# EasyEDA Pro project Databoard.epro

# Schematic Schematic1
Board Name: Board1; Create Date: 2025-08-02; Page Name: P1; Project Name: Databoard; Schematic Name: Schematic1; Update Date: 2025-08-05; Company: EasyEDA.com; Page Size: A4; Version: V1.0
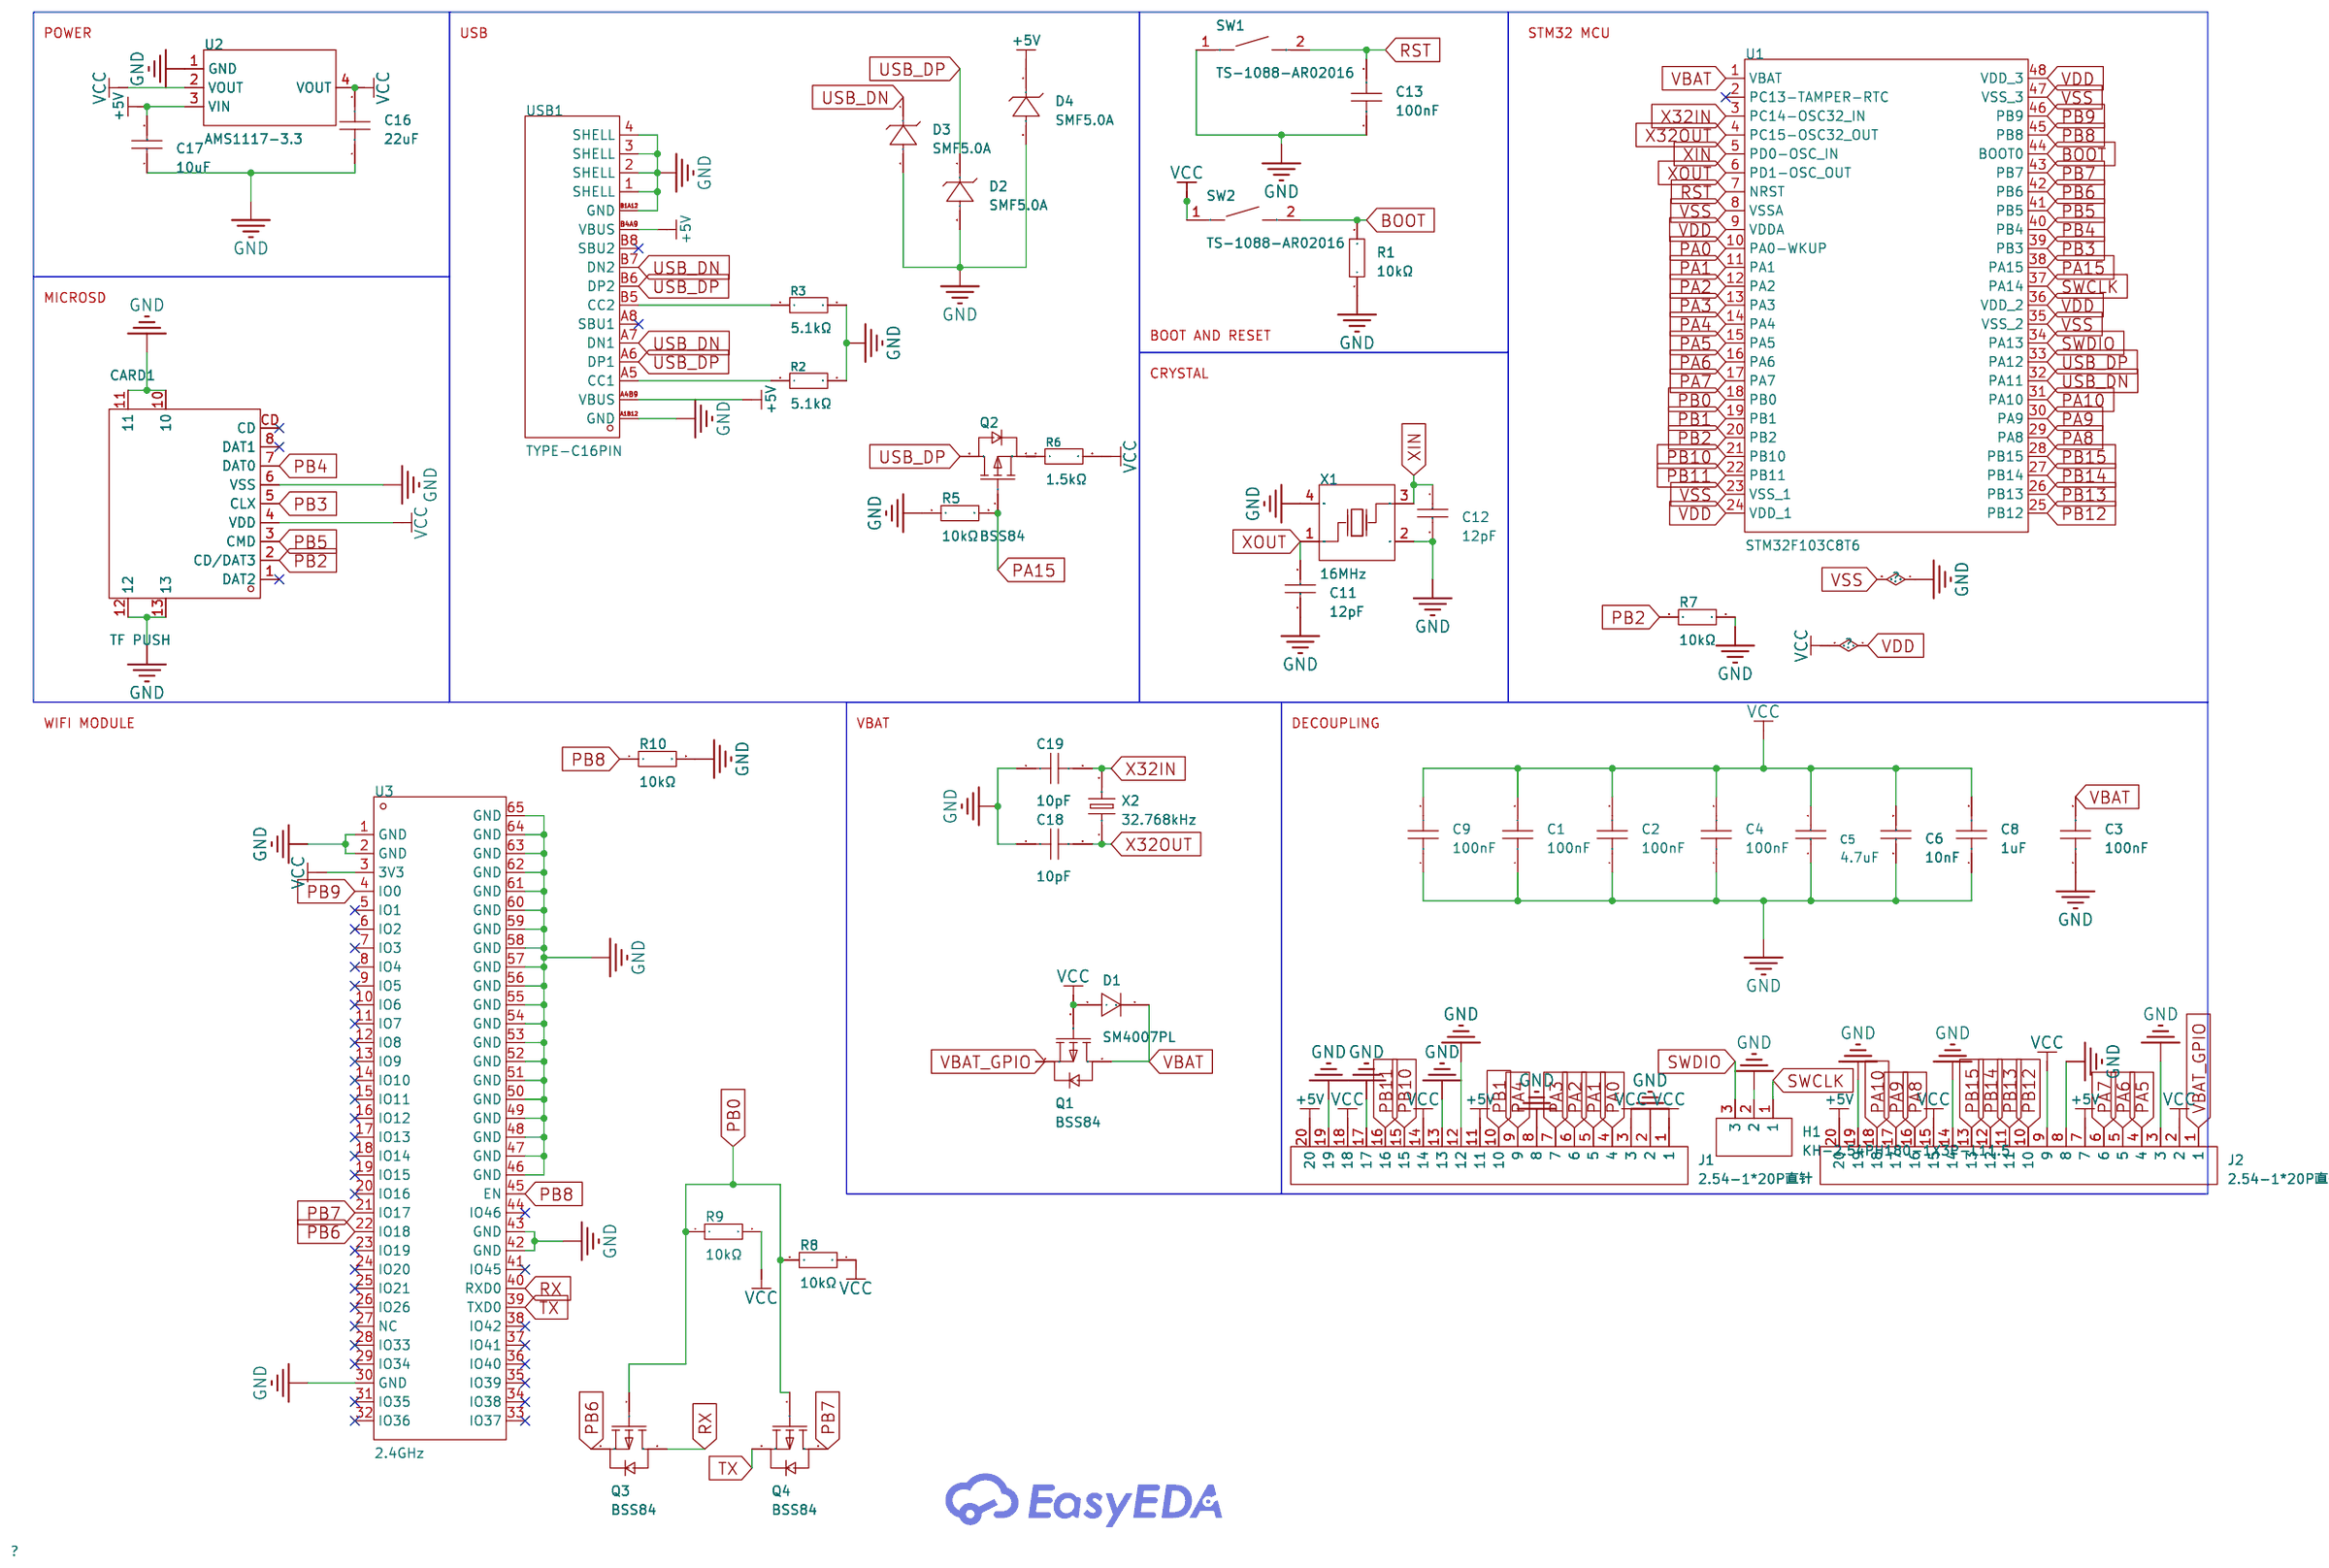
[diagram p0: schematic sheet]

## Parts
C1  100nF  [C0402]
C2  100nF  [C0402]
C3  100nF  [C0402]
C4  100nF  [C0402]
C5  4.7uF  [C0402]
C6  10nF  [C0402]
C8  1uF  [C0402]
C9  100nF  [C0402]
C11  12pF  [C0402]
C12  12pF  [C0402]
C13  100nF  [C0402]
C16  22uF  [C0603]
C17  10uF  [C0402]
C18  10pF  [C0402]
C19  10pF  [C0402]
CARD1  TF PUSH  [TF-SMD_TF-PUSH]
D1  SM4007PL  [SOD-123F_L2.8-W1.8-LS3.7-RD]
D2  SMF5.0A  [SOD-123FL_L2.7-W1.8-LS3.8-RD]
D3  SMF5.0A  [SOD-123FL_L2.7-W1.8-LS3.8-RD]
D4  SMF5.0A  [SOD-123FL_L2.7-W1.8-LS3.8-RD]
H1  KH-2.54PH180-1X3P-L11.5  [HDR-TH_3P-P2.54-V-M]
J1  2.54-1*20P直针  [HDR-TH_20P-P2.54-V-M-1]
J2  2.54-1*20P直针  [HDR-TH_20P-P2.54-V-M-1]
Q1  BSS84  [SOT-23-3_L2.9-W1.3-P1.90-LS2.4-BR-1]
Q2  BSS84  [SOT-23-3_L2.9-W1.3-P1.90-LS2.4-BR-1]
Q3  BSS84  [SOT-23-3_L2.9-W1.3-P1.90-LS2.4-BR-1]
Q4  BSS84  [SOT-23-3_L2.9-W1.3-P1.90-LS2.4-BR-1]
R1  10kΩ  [R0402]
R2  5.1kΩ  [R0402]
R3  5.1kΩ  [R0402]
R5  10kΩ  [R0402]
R6  1.5kΩ  [R0402]
R7  10kΩ  [R0402]
R8  10kΩ  [R0402]
R9  10kΩ  [R0402]
R10  10kΩ  [R0402]
SW1  TS-1088-AR02016  [SW-SMD_L3.9-W3.0-P4.45]
SW2  TS-1088-AR02016  [SW-SMD_L3.9-W3.0-P4.45]
U1  STM32F103C8T6  [LQFP-48_L7.0-W7.0-P0.50-LS9.0-BL]
U2  AMS1117-3.3  [SOT-223-3_L6.5-W3.4-P2.30-LS7.0-BR]
U3  2.4GHz  [WIFI-SMD_ESP32-MINI-1-N4]
USB1  TYPE-C16PIN  [USB-C-SMD_TYPE-C16PIN]
X1  16MHz  [OSC-SMD_4P-L3.2-W2.5-BL]
X2  32.768kHz  [OSC-SMD_L3.2-W1.5]

## Library data of the parts
C1-C4 C9 C13 = CL05B104KB54PNC: Capacitance: Tolerance:±10% Tolerance:±10% Voltage Rated: Temperature Coefficient:; LCSC Part Name: 100nF ±10% 50V; Supplier Part: C307331; Manufacturer: SAMSUNG(三星); Supplier Footprint: 0402; JLCPCB Part Class: Basic Part; Datasheet: https://atta.szlcsc.com/upload/public/pdf/source/20160218/1457707763339.pdf; Supplier: LCSC; Tolerance: ±10%
C5 = CL05A475MP5NRNC: Capacitance: Tolerance:±20% Tolerance:±20% Voltage Rated: Temperature Coefficient:; LCSC Part Name: 4.7uF ±20% 10V; Supplier Part: C23733; Manufacturer: SAMSUNG(三星); Supplier Footprint: 0402; JLCPCB Part Class: Basic Part; Datasheet: https://atta.szlcsc.com/upload/public/pdf/source/20160218/1457707763339.pdf; Supplier: LCSC; Tolerance: ±20%
C6 = CL05B103KB5NNNC: Capacitance: Tolerance:±10% Tolerance:±10% Voltage Rated: Temperature Coefficient:; LCSC Part Name: 10nF ±10% 50V; Supplier Part: C15195; Manufacturer: SAMSUNG(三星); Supplier Footprint: 0402; JLCPCB Part Class: Basic Part; Datasheet: https://atta.szlcsc.com/upload/public/pdf/source/20160218/1457707763339.pdf; Supplier: LCSC; Tolerance: ±10%
C8 = CL05A105KA5NQNC: Capacitance: Tolerance:±10% Tolerance:±10% Voltage Rated: Temperature Coefficient:; LCSC Part Name: 1uF ±10% 25V; Supplier Part: C52923; Manufacturer: SAMSUNG(三星); Supplier Footprint: 0402; JLCPCB Part Class: Basic Part; Datasheet: https://atta.szlcsc.com/upload/public/pdf/source/20160218/1457707763339.pdf; Supplier: LCSC; Tolerance: ±10%
C11 C12 = 0402CG120J500NT: Capacitance: Tolerance:±5% Tolerance:±5% Voltage Rated: Temperature Coefficient:; LCSC Part Name: 12pF ±5% 50V; Supplier Part: C1547; Manufacturer: FH(风华); Supplier Footprint: 0402; JLCPCB Part Class: Basic Part; Datasheet: https://atta.szlcsc.com/upload/public/pdf/source/20200305/C486355_26A10D38EF8C2A5C37091D0039909270.pdf; Supplier: LCSC; Tolerance: ±5%
C16 = CL10A226MQ8NRNC: Capacitance: Tolerance:±20% Tolerance:±20% Voltage Rated: Temperature Coefficient:; LCSC Part Name: 22uF ±20% 6.3V; Supplier Part: C59461; Manufacturer: SAMSUNG(三星); Supplier Footprint: 0603; JLCPCB Part Class: Basic Part; Datasheet: https://atta.szlcsc.com/upload/public/pdf/source/20160218/1457707763339.pdf; Supplier: LCSC; Tolerance: ±20%
C17 = CL05A106MQ5NUNC: Capacitance: Tolerance:±20% Tolerance:±20% Voltage Rated: Temperature Coefficient:; LCSC Part Name: 10uF ±20% 6.3V; Supplier Part: C15525; Manufacturer: SAMSUNG(三星); Supplier Footprint: 0402; JLCPCB Part Class: Basic Part; Datasheet: https://atta.szlcsc.com/upload/public/pdf/source/20220823/2B02EE04F8F211D38A52DCB16EB6BEBA.pdf; Supplier: LCSC; Tolerance: ±20%
C18 C19 = CL05C100JB5NNNC: Capacitance: Tolerance:±5% Tolerance:±5% Voltage Rated: Temperature Coefficient:; LCSC Part Name: 10pF ±5% 50V; Supplier Part: C32949; Manufacturer: SAMSUNG(三星); Supplier Footprint: 0402; JLCPCB Part Class: Basic Part; Datasheet: https://atta.szlcsc.com/upload/public/pdf/source/20160218/1457707763339.pdf; Supplier: LCSC; Tolerance: ±5%
CARD1 = TF PUSH: Card Connection Mode:Self-bouncing Card Type:MicroSD card (TF card) Connector Type:Card Slot Additional Card Detection Pins:None Supplementary Features:- Maximum Body Height:2mm Operating Temperature Range:-20℃~+90℃ Operating Temperature Range:-20℃~+90℃; LCSC Part Name: 自弹式 MicroSD卡(TF卡) 卡座; Supplier Part: C393941; Manufacturer: SHOU HAN(首韩); Supplier Footprint: SMD; JLCPCB Part Class: Extended Part; Datasheet: https://atta.szlcsc.com/upload/public/pdf/source/20191011/C393941_0DDD896EE907FEB750D8B7B8982E2A67.pdf; Supplier: LCSC; Card Connection Mode: Self-bouncing; Card Type: MicroSD card (TF card); Connector Type: Card Slot; Additional Card Detection Pins: None; Maximum Body Height: 2mm; Operating Temperature Range: -20℃~+90℃
D1 = SM4007PL_C64898: Diode Configuration:Independent Type Voltage - Forward(Vf@If):1.1V@1A Voltage - DC Reverse(Vr):1kV Current - Rectified:1A Reverse Leakage Current (Ir):10uA@1kV; Supplier Part: C64898; Manufacturer: MDD(辰达半导体); Supplier Footprint: SOD-123FL; JLCPCB Part Class: Basic Part; Datasheet: https://atta.szlcsc.com/upload/public/pdf/source/20241121/400BA5297D1B92A42708AD93AB64CE21.pdf; Supplier: LCSC; Diode Configuration: Independent Type; Voltage - Forward(Vf@If): 1.1V@1A; Voltage - DC Reverse(Vr): 1kV; Current - Rectified: 1A; Reverse Leakage Current (Ir): 10uA@1kV
D2-D4 = SMF5.0A_C19077497: polarity:Unidirectional Reverse Stand-Off Voltage (Vrwm):5V Maximum Clamping Voltage:7.3V Peak Pulse Current (Ipp):27.4A Peak Pulse Power Dissipation (Ppp):200W Breakdown Voltage:6.4V Reverse Leakage Current (Ir):400uA Number of Lines:Single Channel Opera; Supplier Part: C19077497; Manufacturer: 宏迦橙; Supplier Footprint: SOD-123FL; JLCPCB Part Class: Extended Part; Datasheet: https://atta.szlcsc.com/upload/public/pdf/source/20231129/4813F17DC56F8B344A8D004597B3633C.pdf; Supplier: LCSC; polarity: Unidirectional; Reverse Stand-Off Voltage (Vrwm): 5V; Maximum Clamping Voltage: 7.3V; Peak Pulse Current (Ipp): 27.4A; Peak Pulse Power Dissipation (Ppp): 200W; Breakdown Voltage: 6.4V; Reverse Leakage Current (Ir): 400uA; Number of Lines: Single Channel; Operating Temperature: -55℃~+155℃; Type: TVS
H1 = KH-2.54PH180-1X3P-L11.5: Pin Structure:1x3P Pitch:2.54mm Row Spacing:- Circluar Pins/Square Pins:Policy Mounting Type:Straight Number of Rows:Single Row Number of Pins:3P Current Rating:3A Voltage Rating (Max):- Length of Mating Pin:6mm Insulation Height:2.5mm Length of End Conne; LCSC Part Name: 1x3P 间距:2.54mm 方针 直插; Supplier Part: C2932698; Manufacturer: kinghelm(金航标); Supplier Footprint: 插件,P=2.54mm; JLCPCB Part Class: Extended Part; Datasheet: https://atta.szlcsc.com/upload/public/pdf/source/20211220/D2AB060C07EA7DD91A5B4AA994AB98CA.pdf; Supplier: LCSC; Pin Structure: 1x3P; Pitch: 2.54mm; Circluar Pins/Square Pins: Policy; Mounting Type: Straight; Number of Rows: Single Row; Number of Pins: 3P; Current Rating: 3A; Length of Mating Pin: 6mm; Insulation Height: 2.5mm; Length of End Connection Pin: 3mm; Operating Temperature: -40℃~+105℃; Color: Black
J1 J2 = 2.54-1*20P直针: Pin Structure:1x20P Pitch:2.54mm Row Spacing:- Circluar Pins/Square Pins:Policy Mounting Type:Straight Number of Rows:Single Row Number of Pins:20P Current Rating:3A Voltage Rating (Max):- Length of Mating Pin:- Insulation Height:- Length of End Connectio; LCSC Part Name: 1x20P 间距:2.54mm 方针 直插; Supplier Part: C50981; Manufacturer: BOOMELE(博穆精密); Supplier Footprint: 插件,P=2.54mm; JLCPCB Part Class: Extended Part; Datasheet: https://atta.szlcsc.com/upload/public/pdf/source/20151109/1457707572883.pdf; Supplier: LCSC; Pin Structure: 1x20P; Pitch: 2.54mm; Circluar Pins/Square Pins: Policy; Mounting Type: Straight; Number of Rows: Single Row; Number of Pins: 20P; Current Rating: 3A; Contact Material: Brass; Operating Temperature: -40℃~+105℃; Color: Black
Q1-Q4 = BSS84_C7420340: Type:1 piece P-channel Drain to Source Voltage:60V Current - Continuous Drain(Id):170mA RDS(on):8Ω@10V,0.17A Pd - Power Dissipation:225mW Gate Threshold Voltage (Vgs(th)@Id):900mV Gate Charge(Qg):1.77nC@10V Input Capacitance(Ciss@Vds):43pF Reverse Transfe; LCSC Part Name: P沟道,电流:-0.17A,耐压:-60V; Supplier Part: C7420340; Manufacturer: 宏嘉诚; Supplier Footprint: SOT-23; JLCPCB Part Class: Extended Part; Datasheet: https://atta.szlcsc.com/upload/public/pdf/source/20250106/7DBB75318F8E5F43EACD3BE75B7C3ED0.pdf; Supplier: LCSC; Type: 1 piece P-channel; Drain to Source Voltage: 60V; Current - Continuous Drain(Id): 170mA; RDS(on): 8Ω@10V,0.17A; Pd - Power Dissipation: 225mW; Gate Threshold Voltage (Vgs(th)@Id): 900mV; Gate Charge(Qg): 1.77nC@10V; Input Capacitance(Ciss@Vds): 43pF; Reverse Transfer Capacitance (Crss@Vds): 2.8pF; Operating Temperature: -55℃~+150℃
R1 R5 R7-R10 = 0402WGF1002TCE: Type:Thick Film Resistors Resistance:10kΩ Tolerance:±1% Tolerance:±1% Power(Watts): Overload Voltage (Max): Temperature Coefficient:±100ppm/℃ Temperature Coefficient:±100ppm/℃ Operating Temperature Range:-55℃~+155℃ Operating Temperature Range:-55℃~+155℃; LCSC Part Name: 10kΩ ±1% 62.5mW 厚膜电阻; Supplier Part: C25744; Manufacturer: UNI-ROYAL(厚声); Supplier Footprint: 0402; JLCPCB Part Class: Basic Part; Datasheet: https://atta.szlcsc.com/upload/public/pdf/source/20200306/C422600_1E6D84923E4A46A82E41ADD87F860B5C.pdf; Supplier: LCSC; Type: Thick Film Resistors; Tolerance: ±1%; Temperature Coefficient: ±100ppm/℃; Operating Temperature Range: -55℃~+155℃
R2 R3 = 0402WGF5101TCE: Type:Thick Film Resistor Resistance:5.1kΩ Tolerance:±1% Tolerance:±1% Power(Watts):62.5mW Voltage-Supply(Max):50V Temperature Coefficient:±100ppm/℃ Temperature Coefficient:±100ppm/℃ Operating Temperature:-55℃~+155℃ Operating Temperature:-55℃~+155℃; LCSC Part Name: 5.1kΩ ±1% 62.5mW 厚膜电阻; Supplier Part: C25905; Manufacturer: UNI-ROYAL(厚声); Supplier Footprint: 0402; JLCPCB Part Class: Basic Part; Datasheet: https://atta.szlcsc.com/upload/public/pdf/source/20200306/C422600_1E6D84923E4A46A82E41ADD87F860B5C.pdf; Supplier: LCSC; Type: Thick Film Resistor; Tolerance: ±1%; Power(Watts): 62.5mW; Voltage-Supply(Max): 50V; Temperature Coefficient: ±100ppm/℃; Operating Temperature: -55℃~+155℃
R6 = 0402WGF1501TCE: Type:Thick Film Resistors Resistance:1.5kΩ Tolerance:±1% Tolerance:±1% Power(Watts): Overload Voltage (Max): Temperature Coefficient:±100ppm/℃ Temperature Coefficient:±100ppm/℃ Operating Temperature Range:-55℃~+155℃ Operating Temperature Range:-55℃~+155℃; LCSC Part Name: 1.5kΩ ±1% 62.5mW 厚膜电阻; Supplier Part: C25867; Manufacturer: UNI-ROYAL(厚声); Supplier Footprint: 0402; JLCPCB Part Class: Basic Part; Datasheet: https://atta.szlcsc.com/upload/public/pdf/source/20200306/C422600_1E6D84923E4A46A82E41ADD87F860B5C.pdf; Supplier: LCSC; Type: Thick Film Resistors; Tolerance: ±1%; Temperature Coefficient: ±100ppm/℃; Operating Temperature Range: -55℃~+155℃
SW1 SW2 = TS-1088-AR02016: Circuit:SPST Actuator Style:Round Button Operating Force:160gf Mounting Style:Brick nogging Switch Length:4mm Switch Width:3mm Switch Height:2mm Strike Gundam:不带 Contact Current:50mA Voltage Rating (DC):12V Insulation Resistance:100MΩ Actuator/Cap Color:B; LCSC Part Name: 4*3*2mm 立贴 轻触开关; Supplier Part: C720477; Manufacturer: XUNPU(讯普); Supplier Footprint: SMD; JLCPCB Part Class: Basic Part; Datasheet: https://atta.szlcsc.com/upload/public/pdf/source/20200810/C720475_60D09DD6C54279ADDB2DC25100F1CC11.pdf; Supplier: LCSC; Circuit: SPST; Actuator Style: Round Button; Operating Force: 160gf; Mounting Style: Brick nogging; Switch Length: 4mm; Switch Width: 3mm; Switch Height: 2mm; Strike Gundam: 不带; Contact Current: 50mA; Voltage Rating (DC): 12V; Insulation Resistance: 100MΩ; Actuator/Cap Color: Black; Pin Style: SMDSplicing; Mechanical Life: 10万次; Operating Temperature: -30℃~+80℃
U1 = STM32F103C8T6: CPU Core:ARM-M3 CPU Maximum Speed:72MHz Program Storage Size:64KB Program Memory Type:FLASH Number of I/O:37 ADC (Bit):12bit Voltage - Supply:2V~3.6V Voltage - Supply:2V~3.6V Applications:-; LCSC Part Name: 主流增强型ARM Cortex-M3 MCU，具有64 KB Flash、72 MHz CPU、电机控制、USB和CAN; Supplier Part: C8734; Manufacturer: ST(意法半导体); Supplier Footprint: LQFP-48(7x7); JLCPCB Part Class: Extended Part; Datasheet: https://atta.szlcsc.com/upload/public/pdf/source/20220812/8363ACEC51AD55ECEB84799464F7CB85.pdf; Supplier: LCSC; CPU Core: ARM-M3; CPU Maximum Speed: 72MHz; Program Storage Size: 64KB; Program Memory Type: FLASH; Number of I/O: 37; ADC (Bit): 12bit; Voltage - Supply: 2V~3.6V
U2 = AMS1117-3.3_C6186: Output Type:Fixed Voltage - Supply:16V Output Voltage:3.3V Output Voltage:3.3V Output Current:1A Power Supply Rejection Ratio (PSRR):72dB@(120Hz) Voltage Dropout:1.1V@(800mA) standby current:5mA Noise:- Features:Over Current Protection；Over Temperature Pr; LCSC Part Name: 输出3.3V 1A; Supplier Part: C6186; Manufacturer: AMS; Supplier Footprint: SOT-223; JLCPCB Part Class: Basic Part; Datasheet: https://atta.szlcsc.com/upload/public/pdf/source/20180727/C6186_7A095716F0823C02F1997A905E26C086.pdf; Supplier: LCSC; Output Type: Fixed; Voltage - Supply: 16V; Output Voltage: 3.3V; Output Current: 1A; Power Supply Rejection Ratio (PSRR): 72dB@(120Hz); Voltage Dropout: 1.1V@(800mA); standby current: 5mA; Features: Over Current Protection；Over Temperature Protection; Operating Temperature: -40℃~+125℃; Output Configuration: Positive; Number of Outputs: 1
U3 = ESP32-S2-MINI-2-N4: Core Processor:ESP32-S2FH4 chip Support Interface:I2C；GPIO；SPI；PWM；ADC；UART；USB；I2S Frequency:2.4GHz Output Power:19.5dBm Output Power:19.5dBm; Supplier Part: C3013906; Manufacturer: ESPRESSIF(乐鑫); Supplier Footprint: SMD; JLCPCB Part Class: Extended Part; Datasheet: https://atta.szlcsc.com/upload/public/pdf/source/20220815/99ECD7479F9259A66C7C6E1140388E9F.pdf; Supplier: LCSC; Core Processor: ESP32-S2FH4 chip; Support Interface: I2C；GPIO；SPI；PWM；ADC；UART；USB；I2S; Output Power: 19.5dBm
USB1 = TYPE-C16PIN: Connector Type:Type-C Protocol Standard:USB 3.1 Gender:Female Mounting Type:Surface Mount, Right Angle Number of Contacts:16P Number of Ports:1 Current Rating-Power:3A Voltage Rating:30V Connect-Disconnect Life:10,000 Cycles Detection color:Black Operatin; LCSC Part Name: Type-C 母 卧贴; Supplier Part: C393939; Manufacturer: SHOU HAN(首韩); Supplier Footprint: SMD; JLCPCB Part Class: Extended Part; Datasheet: https://atta.szlcsc.com/upload/public/pdf/source/20250618/9FBF2A26CFCE0E69298FA0B726710E9E.pdf; Supplier: LCSC; Connector Type: Type-C; Protocol Standard: USB 3.1; Gender: Female; Mounting Type: Surface Mount, Right Angle; Number of Contacts: 16P; Number of Ports: 1; Current Rating-Power: 3A; Voltage Rating: 30V; Connect-Disconnect Life: 10,000 Cycles; Detection color: Black; Operating Temperature: -40℃~+85℃
X1 = X322516MLB4SI: Type:Surface Mount Crystal Frequency:16MHz Normal temperature Frequency Tolerance:±10ppm Normal temperature Frequency Tolerance:±10ppm Load Capacitance:9pF Frequency Stability:±20ppm Frequency Stability:±20ppm Operating Temperature:-40℃~+85℃ Operating Tem; LCSC Part Name: YSX321SL 16MHZ 4P 3225 9PF ±10PPM -40~85℃ (±20PPM); Supplier Part: C13738; Manufacturer: YXC(扬兴晶振); Supplier Footprint: SMD3225-4P; JLCPCB Part Class: Basic Part; Datasheet: https://atta.szlcsc.com/upload/public/pdf/source/20240329/19D5F850207469550BEB00D7DFEDBC7A.pdf; Supplier: LCSC; Type: Surface Mount Crystal; Normal temperature Frequency Tolerance: ±10ppm; Load Capacitance: 9pF; Frequency Stability: ±20ppm; Operating Temperature: -40℃~+85℃
X2 = SC-32S32.768kHz20PPM7pF: Type:- Frequency:32.768kHz Normal temperature Frequency Tolerance:±20ppm Normal temperature Frequency Tolerance:±20ppm Load Capacitance: Operating Temperature:- Operating Temperature:-; LCSC Part Name: 32.768kHz ±20ppm 7pF; Supplier Part: C97604; Manufacturer: Seiko(精工); Supplier Footprint: SMD3215-2P; JLCPCB Part Class: Extended Part; Datasheet: https://atta.szlcsc.com/upload/public/pdf/source/20170329/1490752773868.pdf; Supplier: LCSC; Normal temperature Frequency Tolerance: ±20ppm

## Nets
+5V: C17.2 D4.1(K) J1.11 J1.20 J2.7 J2.20 U2.3(VIN) USB1.A4B9(VBUS) USB1.B4A9(VBUS)
GND: C1.1 C2.1 C3.1 C4.1 C5.1 C6.1 C8.1 C9.1 C11.1 C12.2 C13.1 C16.1 C17.1 C18.1 C19.1 CARD1.6(VSS) CARD1.10 CARD1.11 CARD1.12 CARD1.13 D2.2(A) D3.2(A) D4.2(A) H1.2 J1.2 J1.8 J1.12 J1.13 J1.17 J1.19 J2.3 J2.8 J2.14 J2.19 R1.1 R2.2 R3.2 R5.1 R7.1 R10.2 SW1.1 U1.8(VSSA) U1.23(VSS_1) U1.35(VSS_2) U1.47(VSS_3) U2.1(GND) U3.1(GND) U3.2(GND) U3.30(GND) U3.42(GND) U3.43(GND) U3.46(GND) U3.47(GND) U3.48(GND) U3.49(GND) U3.50(GND) U3.51(GND) U3.52(GND) U3.53(GND) U3.54(GND) U3.55(GND) U3.56(GND) U3.57(GND) U3.58(GND) U3.59(GND) U3.60(GND) U3.61(GND) U3.62(GND) U3.63(GND) U3.64(GND) U3.65(GND) USB1.1(SHELL) USB1.2(SHELL) USB1.3(SHELL) USB1.4(SHELL) USB1.A1B12(GND) USB1.B1A12(GND) X1.2(GND) X1.4(GND)
VBAT: C3.2 D1.1(C) Q1.3(D) U1.1(VBAT)
VBAT_GPIO: J2.1 Q1.2(S)
VCC: C1.2 C2.2 C4.2 C5.2 C6.2 C8.2 C9.2 C16.2 CARD1.4(VDD) D1.2(A) J1.1 J1.3 J1.14 J1.18 J2.2 J2.9 J2.15 Q1.1(G) R6.2 R8.1 R9.2 SW2.1 U1.9(VDDA) U1.24(VDD_1) U1.36(VDD_2) U1.48(VDD_3) U2.2(VOUT) U2.4(VOUT) U3.3(3V3)
BOOT: R1.2 SW2.2 U1.44(BOOT0)
PA0: J1.4 U1.10(PA0-WKUP)
PA1: J1.5 U1.11(PA1)
PA2: J1.6 U1.12(PA2)
PA3: J1.7 U1.13(PA3)
PA4: J1.9 U1.14(PA4)
PA5: J2.4 U1.15(PA5)
PA6: J2.5 U1.16(PA6)
PA7: J2.6 U1.17(PA7)
PA8: J2.16 U1.29(PA8)
PA9: J2.17 U1.30(PA9)
PA10: J2.18 U1.31(PA10)
PA15: Q2.1(G) R5.2 U1.38(PA15)
PB0: Q3.1(G) Q4.1(G) R8.2 R9.1 U1.18(PB0)
PB1: J1.10 U1.19(PB1)
PB2: CARD1.2(CD/DAT3) R7.2 U1.20(PB2)
PB3: CARD1.5(CLX) U1.39(PB3)
PB4: CARD1.7(DAT0) U1.40(PB4)
PB5: CARD1.3(CMD) U1.41(PB5)
PB6: Q3.2(S) U1.42(PB6) U3.22(IO18)
PB7: Q4.3(D) U1.43(PB7) U3.21(IO17)
PB8: R10.1 U1.45(PB8) U3.45(EN)
PB9: U1.46(PB9) U3.4(IO0)
PB10: J1.15 U1.21(PB10)
PB11: J1.16 U1.22(PB11)
PB12: J2.10 U1.25(PB12)
PB13: J2.11 U1.26(PB13)
PB14: J2.12 U1.27(PB14)
PB15: J2.13 U1.28(PB15)
RST: C13.2 SW1.2 U1.7(NRST)
RX: Q3.3(D) U3.40(RXD0)
SWCLK: H1.1 U1.37(PA14)
SWDIO: H1.3 U1.34(PA13)
TX: Q4.2(S) U3.39(TXD0)
USB_DN: D3.1(K) U1.32(PA11) USB1.A7(DN1) USB1.B7(DN2)
USB_DP: D2.1(K) Q2.3(D) U1.33(PA12) USB1.A6(DP1) USB1.B6(DP2)
X32IN: C19.2 U1.3(PC14-OSC32_IN) X2.2
X32OUT: C18.2 U1.4(PC15-OSC32_OUT) X2.1
XIN: C12.1 U1.5(PD0-OSC_IN) X1.3(OSC2)
XOUT: C11.2 U1.6(PD1-OSC_OUT) X1.1(OSC1)
$1N4270: R3.1 USB1.B5(CC2)
$1N4274: R2.1 USB1.A5(CC1)
$1N5199: Q2.2(S) R6.1

Not connected (* = marked no-connect by the designer): CARD1 1(DAT2)* 8(DAT1)* CD*; U1 2(PC13-TAMPER-RTC)*; U3 5(IO1)* 6(IO2)* 7(IO3)* 8(IO4)* 9(IO5)* 10(IO6)* 11(IO7)* 12(IO8)* 13(IO9)* 14(IO10)* 15(IO11)* 16(IO12)* 17(IO13)* 18(IO14)* 19(IO15)* 20(IO16)* 23(IO19)* 24(IO20)* 25(IO21)* 26(IO26)* 27(NC)* 28(IO33)* 29(IO34)* 31(IO35)* 32(IO36)* 33(IO37)* 34(IO38)* 35(IO39)* 36(IO40)* 37(IO41)* 38(IO42)* 41(IO45)* 44(IO46)*; USB1 A8(SBU1)* B8(SBU2)*

## Notes on the sheet
- POWER
- USB
- STM32 MCU
- MICROSD
- BOOT AND RESET
- CRYSTAL
- WIFI MODULE
- VBAT
- DECOUPLING

# Board PCB1
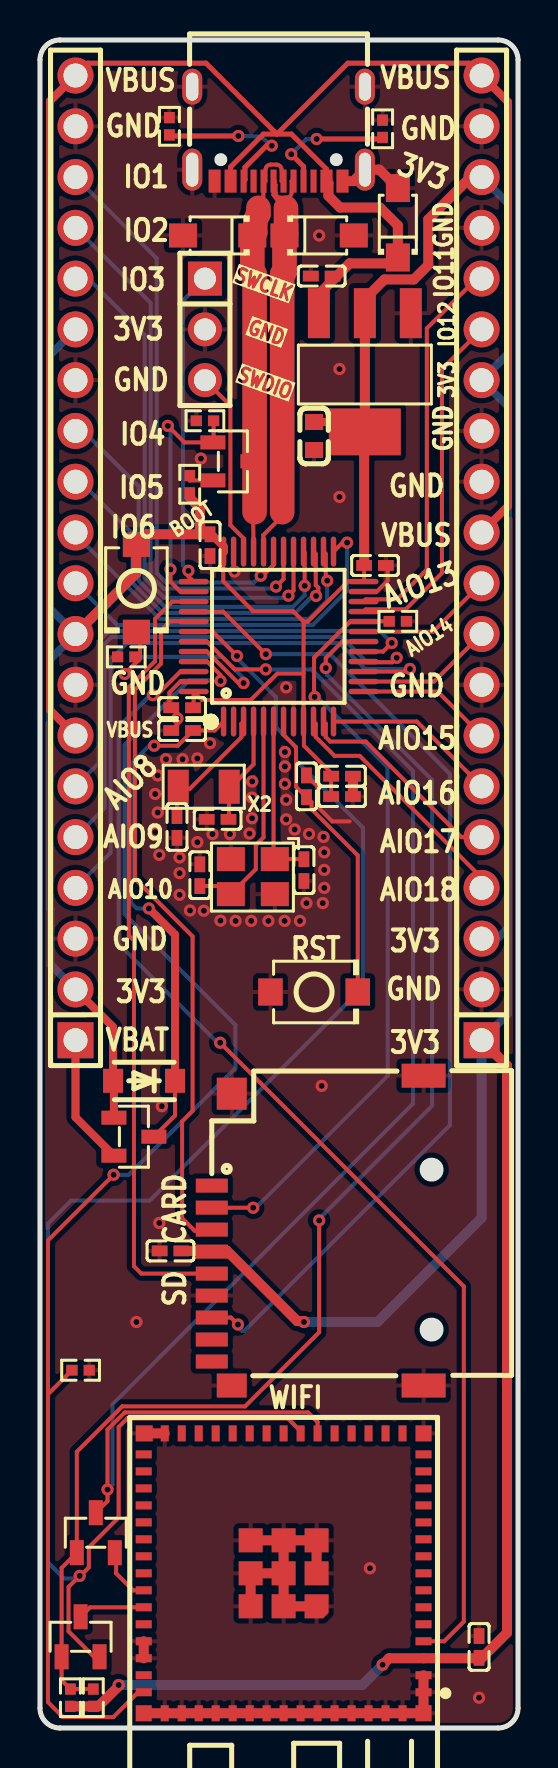
[diagram p1: board, top side]
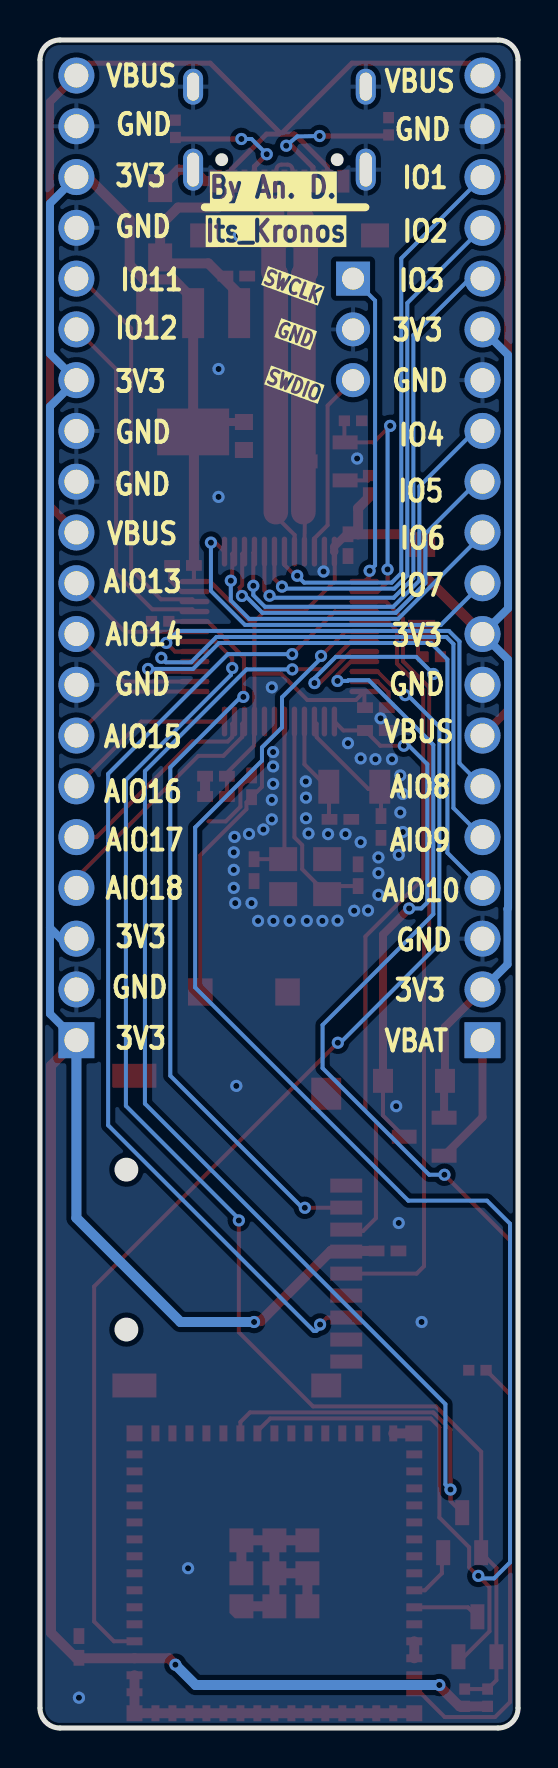
[diagram p2: board, bottom side, seen from below]

Outline 23.92 x 84.45 mm; copper layers: Top Layer, Bottom Layer. Coordinates in mm from the lower left corner of the outline.
Outline path: 0,83.45 0,1 arc(0.29,0.29) 1,0 22.92,0 arc(23.63,0.29) 23.92,1 23.92,83.45 arc(23.63,84.15) 22.92,84.45 1,84.45 arc(0.29,84.15) 0,83.45
Stack: Top Layer 0.035mm / Dielectric1 1.51mm FR4 er 4.5 / Bottom Layer 0.035mm

## Design rules (mm)
net USB_DP: DP1
net USB_DN: DP1
template: Custom Config
spacing copperThickness1oz (default): track to track 0.102, other pairs 0.152 to 0.3
spacing copperThickness2oz: track to track 0.203, other pairs 0.152 to 0.3
track width copperThickness1oz (default): min 0.127, default 0.254, max 2.54
track width copperThickness2oz: min 0.203, default 0.254, max 2.54
differential pair differentialPair (default): width min 0.127, default 0.254, max 2.54; gap min 0.15, default 0.15
via viaSize (default): diameter min 0.5, default 0.61, max 10; hole min 0.3, default 0.305, max 6.3

## Placement (name value [footprint] x y rotation side)
C1  100nF  [C0402]  8.51 59.17 90 top
C2  100nF  [C0402]  16.76 58.16 180 top
C3  100nF  [C0402]  7.11 49.9 0 top
C4  100nF  [C0402]  21.97 4.06 270 top
C5  4.7uF  [C0402]  7.11 51.05 0 top
C6  10nF  [C0402]  15.11 46.6 180 top
C8  1uF  [C0402]  15.11 47.62 180 top
C9  100nF  [C0402]  6.53 23.87 0 top
C11  12pF  [C0402]  13.21 42.92 90 top
C12  12pF  [C0402]  8 42.66 90 top
C13  100nF  [C0402]  13.34 47.11 270 top
C16  22uF  [C0603]  13.72 64.64 90 top
C17  10uF  [C0402]  14.1 72.64 0 top
C18  10pF  [C0402]  8.89 45.46 0 top
C19  10pF  [C0402]  6.86 45.08 90 top
CARD1  TF PUSH  [TF-SMD_TF-PUSH]  13.9 24.88 90 top
D1  SM4007PL  [SOD-123F_L2.8-W1.8-LS3.7-RD]  5.21 32.38 180 top
D2  SMF5.0A  [SOD-123FL_L2.7-W1.8-LS3.8-RD]  8.89 74.67 180 top
D3  SMF5.0A  [SOD-123FL_L2.7-W1.8-LS3.8-RD]  13.97 74.67 0 top
D4  SMF5.0A  [SOD-123FL_L2.7-W1.8-LS3.8-RD]  17.91 75.3 90 top
H1  KH-2.54PH180-1X3P-L11.5  [HDR-TH_3P-P2.54-V-M]  8.25 69.97 270 top
J1  2.54-1*20P直针  [HDR-TH_20P-P2.54-V-M-1]  22.1 58.54 90 top
J2  2.54-1*20P直针  [HDR-TH_20P-P2.54-V-M-1]  1.78 58.54 90 top
Q1  BSS84  [SOT-23-3_L2.9-W1.3-P1.90-LS2.4-BR-1]  4.7 29.58 180 top
Q2  BSS84  [SOT-23-3_L2.9-W1.3-P1.90-LS2.4-BR-1]  9.65 63.37 180 top
Q3  BSS84  [SOT-23-3_L2.9-W1.3-P1.90-LS2.4-BR-1]  2.03 4.56 270 top
Q4  BSS84  [SOT-23-3_L2.9-W1.3-P1.90-LS2.4-BR-1]  2.79 9.77 270 top
R1  10kΩ  [R0402]  4.32 53.59 0 top
R2  5.1kΩ  [R0402]  17.14 80 90 top
R3  5.1kΩ  [R0402]  6.48 80.13 90 top
R5  10kΩ  [R0402]  8.25 65.4 0 top
R6  1.5kΩ  [R0402]  7.49 62.22 270 top
R7  10kΩ  [R0402]  17.91 55.36 180 top
R8  10kΩ  [R0402]  1.52 1.52 90 top
R9  10kΩ  [R0402]  2.67 1.52 270 top
R10  10kΩ  [R0402]  2.03 17.9 0 top
SW1  TS-1088-AR02016  [SW-SMD_L3.9-W3.0-P4.45]  13.72 36.82 0 top
SW2  TS-1088-AR02016  [SW-SMD_L3.9-W3.0-P4.45]  4.83 57.02 270 top
U1  STM32F103C8T6  [LQFP-48_L7.0-W7.0-P0.50-LS9.0-BL]  11.94 54.6 0 top
U2  AMS1117-3.3  [SOT-223-3_L6.5-W3.4-P2.30-LS7.0-BR]  16.26 67.81 90 top
U3  2.4GHz  [WIFI-SMD_ESP32-MINI-1-N4]  12.19 7.74 180 top
USB1  TYPE-C16PIN  [USB-C-SMD_TYPE-C16PIN]  11.94 79.75 180 top
X1  16MHz  [OSC-SMD_4P-L3.2-W2.5-BL]  10.65 42.59 180 top
X2  32.768kHz  [OSC-SMD_L3.2-W1.5]  8.19 47.09 180 top

## Footprints (pads in the part's own frame, mm; a bottom-side part is the same pattern mirrored in y, then rotated)
C0402
  rect 0.79x0.54 smd: 1(-0.545,0) 2(0.545,0)
C0603
  rect 0.8x0.9 smd: 1(-0.7,0) 2(0.7,0)
HDR-TH_3P-P2.54-V-M
  rect 1.7x1.7 hole 1.1: 1(-2.54,0)
  round 1.7 hole 1.1: 2(0,0) 3(2.54,0)
HDR-TH_20P-P2.54-V-M-1
  rect 1.8x1.8 hole 1.2: 1(-24.13,0)
  round 1.8 hole 1.2: 2(-21.59,0) 3(-19.05,0) 4(-16.51,0) 5(-13.97,0) 6(-11.43,0) 7(-8.89,0) 8(-6.35,0) 9(-3.81,0) 10(-1.27,0) 11(1.27,0) 12(3.81,0) 13(6.35,0) 14(8.89,0) 15(11.43,0) 16(13.97,0) 17(16.51,0) 18(19.05,0) 19(21.59,0) 20(24.13,0)
LQFP-48_L7.0-W7.0-P0.50-LS9.0-BL
  oval 0.27x1.5 smd: 1(-2.75,-4.25) 2(-2.25,-4.25) 3(-1.75,-4.25) 4(-1.25,-4.25) 5(-0.75,-4.25) 6(-0.25,-4.25) 7(0.25,-4.25) 8(0.75,-4.25) 9(1.25,-4.25) 10(1.75,-4.25) 11(2.25,-4.25) 12(2.75,-4.25) 25(2.75,4.25) 26(2.25,4.25) 27(1.75,4.25) 28(1.25,4.25) 29(0.75,4.25) 30(0.25,4.25) 31(-0.25,4.25) 32(-0.75,4.25) 33(-1.25,4.25) 34(-1.75,4.25) 35(-2.25,4.25) 36(-2.75,4.25)
  oval 1.5x0.27 smd: 13(4.25,-2.75) 14(4.25,-2.25) 15(4.25,-1.75) 16(4.25,-1.25) 17(4.25,-0.75) 18(4.25,-0.25) 19(4.25,0.25) 20(4.25,0.75) 21(4.25,1.25) 22(4.25,1.75) 23(4.25,2.25) 24(4.25,2.75) 37(-4.25,2.75) 38(-4.25,2.25) 39(-4.25,1.75) 40(-4.25,1.25) 41(-4.25,0.75) 42(-4.25,0.25) 43(-4.25,-0.25) 44(-4.25,-0.75) 45(-4.25,-1.25) 46(-4.25,-1.75) 47(-4.25,-2.25) 48(-4.25,-2.75)
OSC-SMD_4P-L3.2-W2.5-BL
  rect 1.4x1.2 smd: 1(-1.1,-0.875) 2(1.1,-0.875) 3(1.1,0.875) 4(-1.1,0.875)
OSC-SMD_L3.2-W1.5
  rect 1.05x1.7 smd: 1(-1.275,0) 2(1.275,0)
R0402
  rect 0.566x0.54 smd: 1(-0.433,0) 2(0.433,0)
SOD-123F_L2.8-W1.8-LS3.7-RD
  rect 1x1.2 smd: 1(-1.55,0) 2(1.55,0)
SOD-123FL_L2.7-W1.8-LS3.8-RD
  rect 1.4x1.2 smd: 1(-1.735,0) 2(1.735,0)
SOT-23-3_L2.9-W1.3-P1.90-LS2.4-BR-1
  rect 1.25x0.7 smd: 1(1,-0.95) 2(1,0.95) 3(-1,0)
SOT-223-3_L6.5-W3.4-P2.30-LS7.0-BR
  rect 2.5x1.1 smd: 1(2.97,-2.3) 2(2.97,0) 3(2.97,2.3)
  rect 2.34x3.6 smd: 4(-2.97,0)
SW-SMD_L3.9-W3.0-P4.45
  rect 1.23x1.36 smd: 1(-2.185,0) 2(2.185,0)
TF-SMD_TF-PUSH
  rect 0.7x1.6 smd: 1(2.25,5.3) 2(1.15,5.3) 3(0.05,5.3) 4(-1.05,5.3) 5(-2.15,5.3) 6(-3.25,5.3) 7(-4.35,5.3) 8(-5.45,5.3) CD(-6.55,5.3)
  rect 1.2x1.5 smd: 10(-7.75,4.3)
  rect 1.2x2.2 smd: 11(-7.75,-5.3) 12(7.75,-5.3)
  rect 1.6x1.5 smd: 13(6.85,4.3)
USB-C-SMD_TYPE-C16PIN
  oval 1x2.1 hole 0.6x1.7: 1(-4.32,1.788) 2(4.32,1.788)
  oval 1x1.8 hole 0.6x1.4: 3(-4.32,-2.362) 4(4.32,-2.362)
  rect 0.6x1.15 smd: A1B12(-3.2,2.362) A4B9(-2.4,2.362) B1A12(3.2,2.362) B4A9(2.4,2.362)
  rect 0.3x1.15 smd: A5(-1.25,2.362) A6(-0.25,2.362) A7(0.25,2.362) A8(1.25,2.362) B5(1.75,2.362) B6(0.75,2.362) B7(-0.75,2.362) B8(-1.75,2.362)
WIFI-SMD_ESP32-MINI-1-N4
  rect 0.8x0.4 smd: 1(-7,5.95) 2(-7,5.1) 3(-7,4.25) 4(-7,3.4) 5(-7,2.55) 6(-7,1.7) 7(-7,0.85) 8(-7,0.001) 9(-7,-0.85) 10(-7,-1.7) 11(-7,-2.55) 12(-7,-3.4) 13(-7,-4.25) 14(-7,-5.1) 15(-7,-5.949) 31(7,-5.95) 32(7,-5.1) 33(7,-4.25) 34(7,-3.4) 35(7,-2.55) 36(7,-1.7) 37(7,-0.85) 38(7,-0.001) 39(7,0.85) 40(7,1.7) 41(7,2.55) 42(7,3.4) 43(7,4.25) 44(7,5.1) 45(7,5.949)
  rect 0.4x0.8 smd: 16(-5.95,-7) 17(-5.1,-7) 18(-4.25,-7) 19(-3.4,-7) 20(-2.55,-7) 21(-1.7,-7) 22(-0.85,-7) 23(-0.001,-7) 24(0.85,-7) 25(1.7,-7) 26(2.55,-7) 27(3.4,-7) 28(4.25,-7) 29(5.1,-7) 30(5.949,-7) 46(5.95,7) 47(5.1,7) 48(4.25,7) 49(3.4,7) 50(2.55,7) 51(1.7,7) 52(0.85,7) 53(0,7) 54(-0.85,7) 55(-1.7,7) 56(-2.55,7) 57(-3.4,7) 58(-4.25,7) 59(-5.1,7) 60(-5.95,7)
  custom 1.2x1.2 smd: 61(-1.65,1.65)
  rect 1.2x1.2 smd: 61(-1.65,0) 61(-1.65,-1.65) 61(0,1.65) 61(0,0) 61(0,-1.65) 61(1.649,-1.65) 61(1.65,1.65) 61(1.65,0)
  rect 0.8x0.8 smd: 62(-7,7) 63(-7,-7) 65(7,7)
  rect 0.85x0.8 smd: 64(6.975,-7)

## Nets
As in the schematic.

Pads without a net: CARD1 1 8 CD; U1 2; U3 5 6 7 8 9 10 11 12 13 14 15 16 17 18 19 20 23 24 25 26 27 28 29 31 32 33 34 35 36 37 38 41 44; USB1 A8 B8

## Via types
v1: diameter 0.61, hole 0.305, Top Layer to Bottom Layer, 91 vias

## Routing (per net, layer and track width the routed paths; a pad name or vN(x,y) marks a point on that pad's centre or on a via; arc(x,y) is an arc through that point)
+5V: length 101.5
  Top Layer w0.25: J2.20 2.4,83.29 8.31,83.29 11.85,79.74 ; 11.85,79.74 12.58,79.74 14.34,77.98 USB1.A4B9 ; 11.85,79.74 11.18,79.74 9.54,78.1 USB1.B4A9 ; 11.85,79.74 15.4,83.29 21.48,83.29 J1.20
  Top Layer w0.4: J2.7 0.5,50.93 0.5,81.39 J2.20 ; J1.11 23.42,61.13 23.42,81.35 J1.20
  Top Layer w0.5: USB1.A4B9 14.44,77.29 14.44,76.64 15.01,76.06 17.01,76.06 17.91,75.17 D4.1 17.61,73.27 15.49,73.27 13.96,71.73 U2.3
GND: length 45
  Top Layer w0.2: C3.1 6.88,50.22 v1(6.88,50.51) 6.88,50.73 C5.1 6.48,51.14 6.48,51.8 7.03,52.35 U1.47 ; U1.23 16.85,56.85 17.4,57.4 17.4,58.07 C2.1 ; 15.49,45.35 14.63,45.35 13.89,46.09 13.89,47.04 13.92,47.07 C13.1
  Top Layer w0.5: USB1.A1B12 15.68,77.39 USB1.1 16.98,77.96 D4.2 ; U3.61 U3.61 U3.61 ; U3.61 U3.61 U3.61 ; U3.61 U3.61 ; U3.61 U3.61 ; U3.61 U3.61 U3.61 ; U3.65 U3.46 U3.47 U3.48 U3.49 U3.50 U3.51 U3.52 U3.53 U3.54 U3.55 U3.56 U3.57 U3.58 U3.59 U3.60 U3.62 U3.1 U3.2 ; 5.22,14.74 U3.30 ; U3.42 U3.43 ; C8.1 C6.1
  vias: v1(4.83,20.31) v1(5.76,46.73) v1(5.76,44.82) v1(5.89,47.66) v1(5.89,45.8) v1(5.97,43.68) v1(5.97,25.27) v1(6.1,31.11) v1(6.31,48.47) v1(6.98,43.55) v1(6.98,42.77) v1(6.98,41.68) v1(7.13,48.47) v1(7.51,40.9) v1(7.87,48.51) v1(7.87,44.31) v1(8.05,63.51) v1(8.2,40.89) v1(8.51,49.27) v1(8.63,44.72) v1(9.03,40.39) v1(9.5,44.72) v1(9.73,57.86) v1(9.79,40.38) v1(10.48,44.75) v1(10.57,40.38) v1(10.62,47.35) v1(10.61,46.54) v1(10.61,45.51) v1(11.43,40.38) v1(12.26,48.82) v1(12.26,48.1) v1(12.26,47.23) v1(12.24,40.38) v1(12.32,52.06) v1(12.32,46.43) v1(12.32,45.46) v1(12.74,44.95) v1(13.01,40.38) v1(13.34,41.27) v1(13.46,44.73) v1(13.97,74.67) v1(14.19,44.58) v1(14.15,41.27) v1(14.1,32.12) v1(14.22,43.81) v1(14.22,42.93) v1(14.22,42.03) v1(14.99,67.99) v1(14.99,61.59) v1(16.51,7.99) v1(21.97,1.52)
VBAT: length 25.9
  Top Layer w0.2: v1(5.72,49.14) 6.89,49.14 C3.2 8.74,49.9 U1.1 ; D1.1 6.76,30.64 Q1.3
  Top Layer w0.4: D1.1 6.76,39.69 v1(5.45,41)
  Bottom Layer w0.2: v1(5.72,49.14) 5.46,49.14 4.54,48.22 4.54,41.3 4.84,41 v1(5.45,41)
VBAT_GPIO: length 6.6
  Top Layer w0.4: Q1.2 1.78,30.55 J2.1
VCC: length 236.5
  Top Layer w0.2: C5.2 7.69,51.08 U1.48 8.11,51.43 10.54,51.43 11.52,52.4 11.53,52.4 11.88,52.75 13.19,52.75 ; 13.19,55.35 13.19,52.75 ; 13.19,55.35 12.67,55.87 10.67,55.87 9.17,57.37 9.17,58.84 ; 13.19,55.35 13.4,55.35 15.41,57.37 16.17,57.37 U1.24 16.22,57.38 C2.2 ; 13.19,52.75 U1.9 13.21,50.33 13.21,49.14 14.57,47.78 C6.2
  Top Layer w0.4: C1.2 8.58,59.72 9.2,59.1 9.2,58.85 U1.36 ; R6.2 7.49,61.53 ; J2.2 3.66,35.07 D1.2 3.7,32.34 Q1.1 ; U2.4 15.76,65.34 C16.2
  Top Layer w0.5: 8,59.72 8,61.03 7.49,61.53 ; 8,59.72 8.32,59.72 ; 8,59.72 5.34,59.72 SW2.1 4.83,57.78 J2.9 ; C9.2 8.56,23.87 CARD1.4 8.64,23.88 9.35,23.88 12.87,20.36 13.16,20.36 v1(13.21,20.31) ; R8.1 R9.2 2.92,1.08 3.94,2.1 v1(3.94,2.15) ; v1(17.14,3.17) 17.47,3.49 U3.3 21.95,3.49 C4.2 22.11,3.51 23.37,4.77 23.37,33.14 J1.1 ; C2.2 16.22,64.8 U2.4 U2.2 16.26,71.49 17.23,72.47 18.71,72.47 19.43,73.19 19.43,75.47 21.55,77.59 J1.18
  Bottom Layer w0.4: J1.18 23.42,76.27 23.42,68.75 J1.14 23.42,66.11 23.42,40.03 ; J2.15 0.5,68.69 0.5,56.01 J2.9 0.5,53.45 0.5,41.01 0.53,40.99 0.53,38.2 J2.2 ; 23.42,40.03 22.88,39.49 J1.3 ; 23.42,40.03 23.42,35.73 J1.1
  Bottom Layer w0.5: J1.1 22.1,25.52 16.89,20.31 v1(13.21,20.31) ; v1(3.94,2.15) 16.13,2.15 v1(17.14,3.17)
BOOT: length 12.6
  Top Layer w0.2: v1(4.24,52.73) 5,53.49 5,54.65 SW2.2 ; U1.44 8.35,53.85 9.93,52.28 v1(10.19,52.28)
  Bottom Layer w0.2: v1(4.24,52.73) 5.1,53.59 9.12,53.59 10.19,52.52 v1(10.19,52.28)
PA0: length 12.5
  Top Layer w0.2: U1.10 13.8,50.24 13.8,49.58 14.74,48.63 16,48.63 22.1,42.54 J1.4
PA1: length 10.7
  Top Layer w0.2: J1.5 21.08,44.57 16.3,49.35 14.53,49.35 14.3,49.58 14.3,50.24 U1.11
PA2: length 8.8
  Top Layer w0.2: U1.12 18.85,50.35 J1.6
PA3: length 6.8
  Top Layer w0.2: U1.13 19.89,51.85 J1.7
PA4: length 6.9
  Top Layer w0.2: U1.14 19.72,52.35 J1.9
PA5: length 30.4
  Top Layer w0.2: U1.15 18.38,52.85 v1(18.51,52.98)
  Bottom Layer w0.2: J2.4 3.53,43.78 3.53,53.46 4.35,54.28 14.97,54.28 16.26,52.98 v1(18.51,52.98)
PA6: length 27.4
  Top Layer w0.2: U1.16 16.22,53.32 17.63,53.32 v1(17.85,53.54)
  Bottom Layer w0.2: J2.5 3.23,46.02 3.23,54.23 3.58,54.58 15.09,54.58 16.35,53.32 17.63,53.32 v1(17.85,53.54)
PA7: length 24.5
  Top Layer w0.2: U1.17 17.17,53.85 v1(17.6,54.28)
  Bottom Layer w0.2: J2.6 2.93,48.26 2.93,54.36 3.45,54.88 17,54.88 v1(17.6,54.28)
PA8: length 26.7
  Top Layer w0.2: U1.29 12.69,56.9 v1(12.43,56.65)
  Bottom Layer w0.2: v1(12.43,56.65) 12.33,56.54 6.22,56.54 5.24,57.53 5.24,69.68 2.41,72.51 J2.16
PA9: length 27.4
  Top Layer w0.2: U1.30 12.19,57.48 v1(11.81,57.1)
  Bottom Layer w0.2: v1(11.81,57.1) 11.71,57 6.19,57 5.54,57.65 5.54,71.29 J2.17
PA10: length 28.6
  Top Layer w0.2: U1.31 11.69,58.19 11.14,57.64 v1(11.05,57.64)
  Bottom Layer w0.2: J2.18 5.84,73.53 5.84,57.78 6.32,57.3 10.7,57.3 v1(11.05,57.64)
PA15: length 12.9
  Top Layer w0.2: v1(6.4,65.14) 7.23,64.31 Q2.1 8.69,64.35 R5.2 ; v1(6.53,57.96) 6.53,57.35 7.03,56.85 U1.38
  Bottom Layer w0.2: v1(6.53,57.96) 6.53,65.01 v1(6.4,65.14)
PB0: length 68.6
  Top Layer w0.2: v1(13.97,25.39) 13.97,19.8 10.26,16.09 4.11,16.09 1.84,13.82 Q4.1 1.08,8.01 Q3.1 1.08,2.39 R8.2 R9.1 ; U1.18 15.13,54.35 14.3,53.52 v1(14.3,53.03)
  Bottom Layer w0.2: v1(14.3,53.03) 14.36,52.96 14.36,52.68 19.62,47.43 19.62,31.12 14.03,25.54 14.03,25.46 v1(13.97,25.39)
PB1: length 6.9
  Top Layer w0.2: U1.19 16.2,54.84 19.67,54.84 J1.10
PB2: length 38.6
  Top Layer w0.2: v1(10.67,26.03) 8.6,26.03 CARD1.2 ; R7.2 16.2,55.36 U1.20 15.53,55.35 13.72,53.54 13.72,51.55
  Bottom Layer w0.2: v1(13.75,51.58) 13.87,51.58 17.4,48.06 17.4,32.63 10.79,26.03 v1(10.67,26.03)
PB3: length 39.4
  Top Layer w0.2: CARD1.5 5.07,22.73 4.7,23.1 4.7,39.39 4.44,39.65 4.44,52.06 5.76,53.38 5.76,55.49 6.62,56.35 U1.39
PB4: length 50.3
  Top Layer w0.2: v1(9.91,20.19) 9.56,20.53 CARD1.7 ; v1(11.3,53.72) 11.29,53.72 9.16,55.85 U1.40
  Bottom Layer w0.2: v1(9.91,20.19) 9.91,20.06 10.1,19.87 10.22,19.87 20.51,30.15 20.51,47.73 14.52,53.72 v1(11.3,53.72)
PB5: length 34.9
  Top Layer w0.2: CARD1.3 8.09,24.93 8.03,24.87 7.74,24.87 7.11,25.5 7.11,30.35 7.64,30.87 7.64,39.6 4.75,42.49 4.75,51.94 6.06,53.25 6.06,54.89 6.53,55.36 7.68,55.36 U1.41
PB6: length 84.4
  Top Layer w0.2: U3.22 13.04,14.85 12.4,15.49 4.37,15.49 3.94,15.06 3.94,10.53 2.45,9.04 2.45,8.04 2.02,7.61 v1(1.99,7.61) 1.43,7.06 1.43,4.83 2.7,3.56 Q3.2 ; v1(9.86,53.63) 8.64,54.85 U1.42
  Bottom Layer w0.2: v1(9.86,53.63) 9.86,53.52 11.81,51.56 11.81,50.06 12.81,49.05 12.81,48.39 16.16,45.05 16.16,37.05 5.49,26.38 1.55,26.38 0.4,25.23 0.4,8.28 1.2,7.49 1.86,7.49 v1(1.99,7.61)
PB7: length 72
  Top Layer w0.2: U3.21 13.89,15.31 13.41,15.79 4.24,15.79 4.19,15.74 3.38,14.93 v1(3.38,11.93) 3.38,11.36 Q4.3 ; U1.43 8.35,54.35 9.74,52.96 v1(11.3,52.96)
  Bottom Layer w0.2: v1(3.38,11.93) 3.63,12.18 3.63,16.2 18.67,31.23 18.67,47.87 13.58,52.96 v1(11.3,52.96)
PB8: length 69.9
  Top Layer w0.2: U3.45 4.91,1.79 3.67,0.55 1.15,0.55 0.4,1.3 0.4,16.7 ; 0.4,16.7 R10.1 ; 0.4,16.7 0.4,24.39 v1(3.68,27.68) ; U1.45 8.36,53.35 9.03,52.68 v1(9.03,52.38)
  Bottom Layer w0.2: v1(3.68,27.68) 4.44,27.68 9.78,33.01 9.78,35.17 4.24,40.71 4.24,49.19 7.47,52.42 8.49,52.42 8.53,52.38 v1(9.03,52.38)
PB9: length 59.3
  Top Layer w0.2: U3.4 20.22,4.34 21.21,5.33 21.21,22.09 v1(9.02,34.28) ; U1.46 7.03,52.85 5.85,51.67 v1(5.65,51.67)
  Bottom Layer w0.2: v1(9.02,34.28) 8.89,34.28 3.94,39.23 3.94,50.09 5.52,51.67 v1(5.65,51.67)
PB10: length 17.7
  Top Layer w0.2: U1.21 16.3,55.97 18.3,55.97 20.11,57.78 20.11,67.98 J1.15
PB11: length 19.7
  Top Layer w0.2: J1.16 21.84,72.51 19.36,70.02 19.36,57.96 17.86,56.47 16.3,56.47 U1.22
PB12: length 18.4
  Top Layer w0.2: U1.25 15.14,59.3 v1(15.37,59.3)
  Bottom Layer w0.2: v1(15.37,59.3) 15.37,56.89 13.66,55.18 3.86,55.18 J2.10
PB13: length 17.3
  Top Layer w0.2: 14.35,57.4 14.3,57.45 14.3,58.74 U1.26
  Bottom Layer w0.2: v1(14.37,57.4) 14.37,56.4 13.45,55.49 6,55.49 1.78,59.71 J2.11
PB14: length 18.8
  Top Layer w0.2: U1.27 13.8,58.74 13.8,57.18 13.93,57.05 13.93,56.75 v1(13.81,56.63)
  Bottom Layer w0.2: 13.72,56.63 13.63,56.63 12.79,55.79 6.12,55.79 4.63,57.28 4.63,59.75 2.03,62.35 J2.12
PB15: length 20.3
  Top Layer w0.2: v1(13.25,57.14) 13.25,58.8 U1.28
  Bottom Layer w0.2: v1(13.25,57.14) 13.25,56.67 12.66,56.09 6.25,56.09 4.94,57.4 4.94,62.11 2.16,64.89 J2.13
RST: length 15.1
  Top Layer w0.2: U1.7 12.19,49.69 12.81,49.06 12.81,47.09 C13.2 13.59,46.31 13.59,45.97 15.9,43.65 15.9,36.82
RX: length 3.4
  Top Layer w0.2: U3.40 2.51,6.04 Q3.3
SWCLK: length 15.8
  Top Layer w0.2: v1(7.43,57.89) 7.43,57.61 U1.37
  Bottom Layer w0.2: 8.25,72.51 7.15,71.41 7.15,58.17 v1(7.43,57.89)
SWDIO: length 9.4
  Top Layer w0.2: U1.34 10.19,59.51 9.53,60.17 9.53,66.16 H1.3
TX: length 2.8
  Top Layer w0.2: U3.39 4.66,6.89 3.81,7.74 3.81,8.71 Q4.2
USB_DN: length 20.8
  Top Layer w0.2: 12.06,76.19 11.68,76.7 USB1.A7 11.74,77.39 11.74,77.24 11.79,77.19 11.79,76.81 arc(11.86,76.63) 12.04,76.56 12.34,76.56 arc(12.52,76.63) 12.59,76.81 12.59,77.39 USB1.B7 ; 11.81,60.32 11.18,59.68 U1.32
  Top Layer w1.229: 12.12,60.83 12.12,72.72 12.23,72.84 D3.1 12.31,74.74 12.31,76.04
USB_DP: length 20.2
  Top Layer w0.2: USB1.A6 12.09,77.39 12.09,77.96 arc(12.02,78.14) 11.84,78.21 11.54,78.21 arc(11.36,78.14) 11.29,77.96 11.29,77.39 USB1.B6 11.18,76.57 ; U1.33 10.67,60.44
  Top Layer w1.229: 10.74,60.83 10.74,72.72 10.62,72.84 D2.1 10.77,74.81 10.77,75.27 arc(10.81,75.52) 10.93,75.74 10.93,76.05
X32IN: length 6.9
  Top Layer w0.2: U1.3 10.07,50.24 10.07,49.56 7.49,46.98 6.54,46.98 6.86,46.67 C19.2
X32OUT: length 5.4
  Top Layer w0.2: U1.4 10.69,48.21 9.46,46.98 9.46,45.48 9.44,45.46
XIN: length 11
  Top Layer w0.2: C12.1 9.15,42.12 X1.3 10.8,42.96 10.8,44.17 11.19,44.56 U1.5
XOUT: length 8.4
  Top Layer w0.2: U1.6 11.69,43.53 X1.1 13.2,43.47 C11.2
$1N4270: length 7.8
  Top Layer w0.254: R3.1 6.53,79.64 v1(9.93,79.64) ; v1(11.6,79.16) 11.34,79.16 10.26,78.08 10.26,77.46 USB1.B5
  Bottom Layer w0.2: v1(9.93,79.64) 11.05,79.62 v1(11.6,79.16)
$1N4274: length 6.5
  Top Layer w0.254: USB1.A5 13.19,78.12 v1(12.57,78.73) ; v1(13.84,79.49) 17.07,79.49 R2.1
  Bottom Layer w0.2: v1(12.57,78.73) 13.34,79.49 v1(13.84,79.49)
$1N5199: length 1.4
  Top Layer w0.2: R6.1 7.49,62.4 ; 7.51,62.42 Q2.2

## Copper pours and planes (outline as drawn; the poured copper is in the pictures)
GND on Top Layer: -3.56,90.29 26.03,90.29 26.03,-0.77 -3.56,-0.77
GND on Bottom Layer: -20.83,94.73 38.48,94.73 38.48,-8.77 -20.83,-8.77

## Text on the board
Bottom Silkscreen Layer: GND | SWDIO | SWCLK | IO2 | IO1 | IO6 | IO3 | IO4 | IO7 | IO5 | 3V3 | AIO8 | AIO9 | VBUS | VBAT | AIO10 | IO11 | IO12 | AIO17 | AIO18 | AIO14 | AIO16 | AIO15 | AIO13 | By An. D. | Its_Kronos
Top Silkscreen Layer: SWCLK | SWDIO | GND | VBUS | BOOT | AIO14 | IO12 | 3V3 | AIO10 | IO11 | AIO9 | VBAT | IO6 | IO5 | IO3 | IO4 | IO1 | IO2 | WIFI | RST | AIO15 | AIO16 | AIO17 | AIO18 | AIO13 | AIO8 | SD  CARD | Its_Kronos
